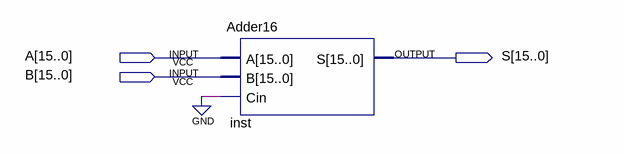
[diagram p0: schematic sheet]
// Quartus schematic Adder16a0.bdf as structural Verilog: 1 symbols, 3 pins
module Adder16a0 (
  input  [15:0] A,
  input  [15:0] B,
  output [15:0] S
);

  Adder16 inst (.A(A), .B(B), .Cin(1'b0), .S(S));
endmodule
